# EAGLE design SESSION 3 FINAL (EAGLE 9.6.2)
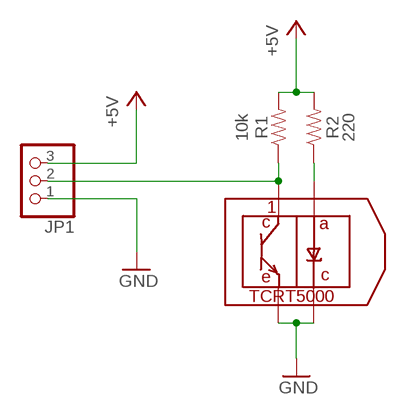
[diagram p0: schematic, sheet 1]

## Parts
1  TCRT5000  [5000]
JP1  PINHD-1X3  [1X03]
R1  10k  RESISTORAXIAL-0.3  [AXIAL-0.3]
R2  220  RESISTORAXIAL-0.3  [AXIAL-0.3]

## Nets
+5V: JP1.3 R1.P$2 R2.P$2
GND: 1.P$2 1.P$4 JP1.1
N$1: 1.P$1 JP1.2 R1.P$1
N$2: 1.P$3 R2.P$1

## Library data of the parts
1 = qfm-trx1-24g:TCRT5000: Reflective Optical Sensor with Transistor Output. Vishay Semiconductors
JP1 = pinhead:PINHD-1X3: PIN HEADER
R1 R2 = SparkFun-Resistors:RESISTOR: Generic Resistor Package

## Board
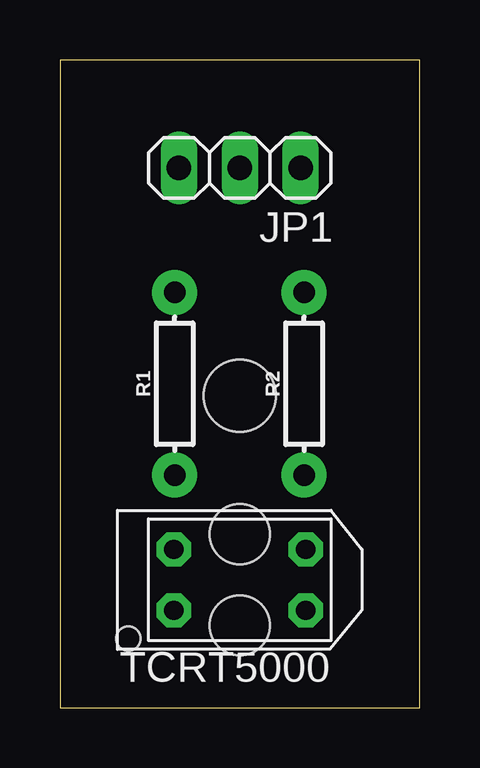
[diagram p1: board, top side]
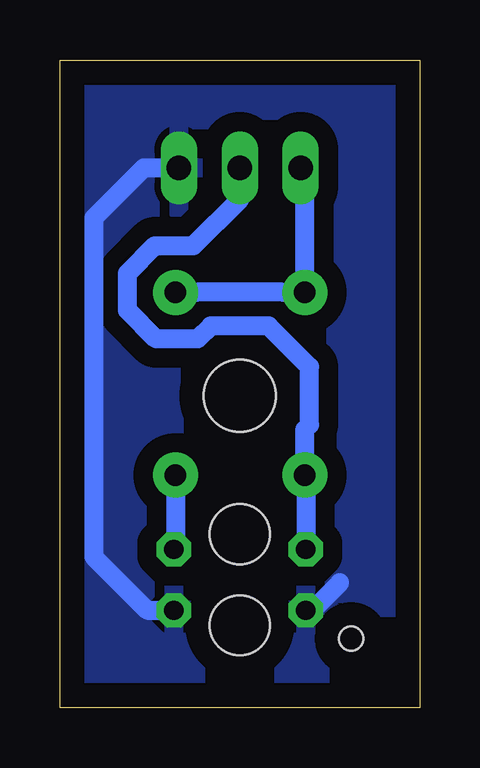
[diagram p2: board, bottom side, seen from below]

Size 15 x 27 mm. Coordinates in mm from the lower left corner, seen from the top.
Outline: 0,0 15,0 15,27 0,27 0,0
Copper layers (1*16): Top 0.035mm / dielectric 1.5mm / Bottom 0.035mm
Design rules "default *": minimum track width 0.8mm, minimum drill 0.7mm, track to track 0.6mm, track to pad 0.6mm, pad to pad 0.6mm, via to via 0.6mm, smd to smd 0.6mm, copper to edge 40mil, drill to drill 6mil, minimum pad ring 10mil, minimum via ring 8mil, stop-mask expansion 4mil, vias tented up to drill 0mil, thermal gap 10mil
Holes 3 mm at 7.5,13

### Footprints (pad centres in the part's own frame; a part is rotated, then mirrored left to right if it is on the bottom)
5000 = drill 0.8 pad 1.422 octagon: P$1 -2.75,1.27; P$2 -2.75,-1.27; P$3 2.75,1.27; P$4 2.75,-1.27 | hole 2.5: 0,1.9; 0,-1.9 | hole 1: -4.65,-2.45
1X03 = drill 1.016 long: 1 -2.54,0; 2 0,0; 3 2.54,0
AXIAL-0.3 = drill 0.9 pad 1.88: P$1 -3.81,0; P$2 3.81,0

### Placement (x,y rotation side)
1  7.5,5.33 0 top
JP1  7.5,22.5 180 top
R1  4.79,13.5 90 top
R2  10.18,13.5 90 top

### Tracks (layer width: path | path; a pad name or v marks a point on that pad's centre or on a via)
+5V
  Bottom 0.8: JP1.3 4.79,22.32 R1.P$2 5.71,17.31 5.71,17.32 9.29,17.32 9.29,17.31 R2.P$2
GND
  Bottom 0.8: JP1.1 11.5,22.5 13.58,20.42 13.58,6.29 11.36,4.06 1.P$4 | 1.P$2 4.47,4.06 3.33,5.2
  pour Bottom (isolate 0.8): 0,0 0,25.99 14.94,25.99 14.97,25.96 14.97,0.09 15,0.07 0.07,0.07 0,0
N$1
  Bottom 0.8: 1.P$1 4.75,10.23 R1.P$1 4.79,11.59 4.58,11.79 4.58,14.21 6.29,15.92 8.71,15.92 9.25,15.37 10.99,15.37 12.18,16.57 12.18,18.1 11.04,19.25 9.44,19.25 7.5,21.19 JP1.2
N$2
  Bottom 0.8: R2.P$1 10.18,6.66 1.P$3

### Text on the board
tNames: 5V A0 GND